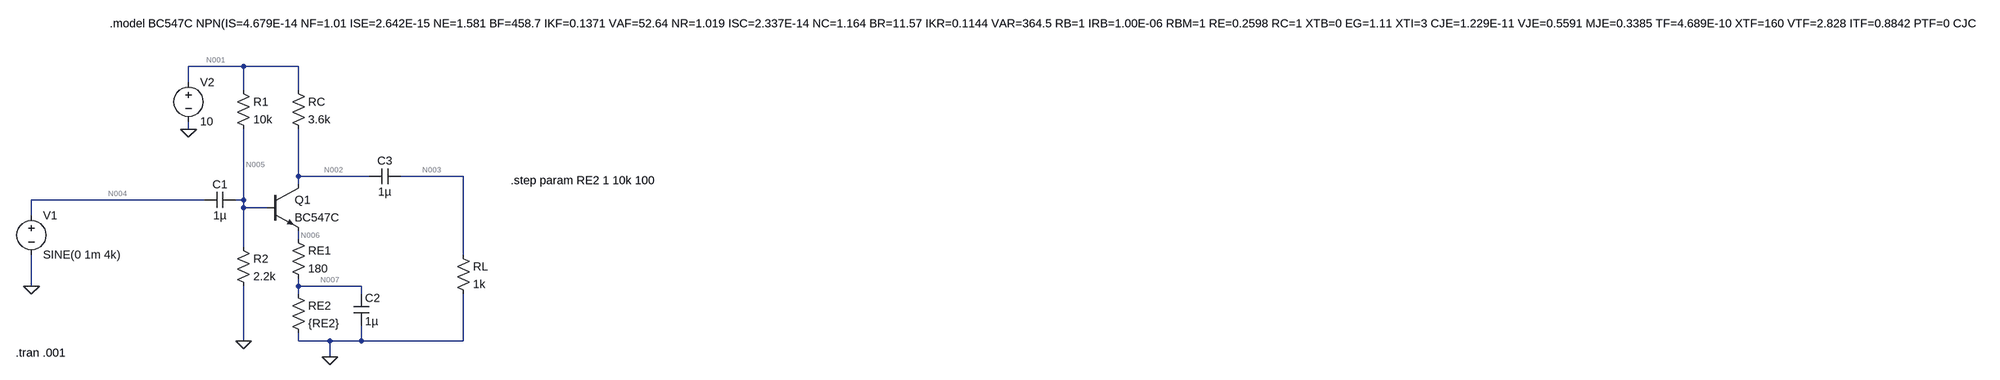
[diagram p0: schematic Draft1.asc]
Draft1.asc, the LTspice schematic file:
Version 4
SHEET 1 5676 680
WIRE 208 -240 96 -240
WIRE 320 -240 208 -240
WIRE 96 -208 96 -240
WIRE 208 -192 208 -240
WIRE 320 -192 320 -240
WIRE 96 -112 96 -128
WIRE 320 -16 320 -112
WIRE 464 -16 320 -16
WIRE 656 -16 528 -16
WIRE 320 0 320 -16
WIRE 128 32 -224 32
WIRE 208 32 208 -112
WIRE 208 32 192 32
WIRE 208 48 208 32
WIRE 256 48 208 48
WIRE -224 64 -224 32
WIRE 320 112 320 96
WIRE 208 128 208 48
WIRE 656 144 656 -16
WIRE -224 208 -224 144
WIRE 320 208 320 192
WIRE 448 208 320 208
WIRE 320 224 320 208
WIRE 448 224 448 208
WIRE 208 320 208 208
WIRE 320 320 320 304
WIRE 384 320 320 320
WIRE 448 320 448 288
WIRE 448 320 384 320
WIRE 656 320 656 224
WIRE 656 320 448 320
WIRE 384 352 384 320
FLAG 96 -112 0
FLAG -224 208 0
FLAG 208 320 0
FLAG 384 352 0
SYMBOL voltage -224 48 R0
WINDOW 123 0 0 Left 0
WINDOW 39 0 0 Left 0
SYMATTR InstName V1
SYMATTR Value SINE(0 1m 4k)
SYMBOL res 304 208 R0
SYMATTR InstName RE2
SYMATTR Value {RE2}
SYMBOL res 304 96 R0
SYMATTR InstName RE1
SYMATTR Value 180
SYMBOL cap 192 16 R90
WINDOW 0 0 32 VBottom 2
WINDOW 3 32 32 VTop 2
SYMATTR InstName C1
SYMATTR Value 1µ
SYMBOL cap 528 -32 R90
WINDOW 0 0 32 VBottom 2
WINDOW 3 32 32 VTop 2
SYMATTR InstName C3
SYMATTR Value 1µ
SYMBOL res 640 128 R0
SYMATTR InstName RL
SYMATTR Value 1k
SYMBOL res 304 -208 R0
SYMATTR InstName RC
SYMATTR Value 3.6k
SYMBOL res 192 -208 R0
SYMATTR InstName R1
SYMATTR Value 10k
SYMBOL voltage 96 -224 R0
WINDOW 123 0 0 Left 0
WINDOW 39 0 0 Left 0
SYMATTR InstName V2
SYMATTR Value 10
SYMBOL res 192 112 R0
SYMATTR InstName R2
SYMATTR Value 2.2k
SYMBOL cap 432 224 R0
SYMATTR InstName C2
SYMATTR Value 1µ
SYMBOL npn 256 0 R0
SYMATTR InstName Q1
SYMATTR Value BC547C
TEXT -64 -328 Left 2 !.model BC547C NPN(IS=4.679E-14 NF=1.01 ISE=2.642E-15 NE=1.581 BF=458.7 IKF=0.1371 VAF=52.64 NR=1.019 ISC=2.337E-14 NC=1.164 BR=11.57 IKR=0.1144 VAR=364.5 RB=1 IRB=1.00E-06 RBM=1 RE=0.2598 RC=1 XTB=0 EG=1.11 XTI=3 CJE=1.229E-11 VJE=0.5591 MJE=0.3385 TF=4.689E-10 XTF=160 VTF=2.828 ITF=0.8842 PTF=0 CJC=4.42E-12 VJC=0.1994 MJC=0.2782 XCJC=0.6193 TR=1.00E-32 CJS=0 VJS=0.75 MJS=0.333 FC=0.7936 Vceo=45 Icrating=100m mfg=Philips)
TEXT 752 -8 Left 2 !.step param RE2 1 10k 100
TEXT -256 344 Left 2 !.tran .001

The netlist it stands for:
* Draft1.asc
V1 N004 0 SINE(0 1m 4k)
RE2 N007 0 {RE2}
RE1 N006 N007 180
C1 N005 N004 1µ
C3 N003 N002 1µ
RL N003 0 1k
RC N001 N002 3.6k
R1 N001 N005 10k
V2 N001 0 10
R2 N005 0 2.2k
C2 N007 0 1µ
Q1 N002 N005 N006 0 BC547C
.model NPN NPN
.model PNP PNP
.lib standard.bjt
.model BC547C NPN(IS=4.679E-14 NF=1.01 ISE=2.642E-15 NE=1.581 BF=458.7 IKF=0.1371 VAF=52.64 NR=1.019 ISC=2.337E-14 NC=1.164 BR=11.57 IKR=0.1144 VAR=364.5 RB=1 IRB=1.00E-06 RBM=1 RE=0.2598 RC=1 XTB=0 EG=1.11 XTI=3 CJE=1.229E-11 VJE=0.5591 MJE=0.3385 TF=4.689E-10 XTF=160 VTF=2.828 ITF=0.8842 PTF=0 CJC=4.42E-12 VJC=0.1994 MJC=0.2782 XCJC=0.6193 TR=1.00E-32 CJS=0 VJS=0.75 MJS=0.333 FC=0.7936 Vceo=45 Icrating=100m mfg=Philips)
.step param RE2 1 10k 100
.tran .001
.backanno
.end

* Results of the author's LTspice run, read from the files saved beside the schematic
* Operating Point (first step), zero values left out:
*   re2 = 1 
*   V(n007) = 2.956 mV
*   V(n006) = 535.1 mV
*   V(n005) = 1.205 V
*   V(n002) = 551.9 mV
*   V(n001) = 10 V
*   Ic(Q1) = 2.624 mA
*   Ib(Q1) = 331.9 µA
*   Ie(Q1) = -2.956 mA
*   I(Re2) = 2.956 mA
*   I(Re1) = 2.956 mA
*   I(Rc) = 2.624 mA
*   I(R1) = 879.5 µA
*   I(R2) = 547.6 µA
*   I(V2) = -3.504 mA
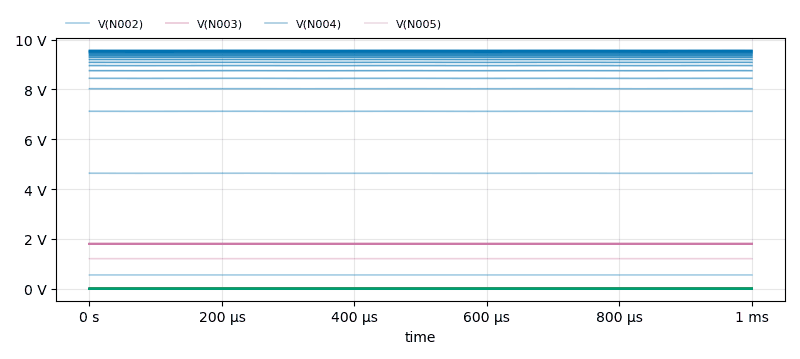
[diagram p1: Transient Analysis of Draft1.asc, plotted from the saved traces]
* Transient Analysis, 101 runs:
*   V(N002) [run 1]: min 551.3 mV, max 552.5 mV, average 551.9 mV, rms 551.9 mV, last 552.1 mV
*   V(N002) [run 2]: min 4.63 V, max 4.638 V, average 4.634 V, rms 4.634 V, last 4.634 V
*   V(N002) [run 3]: min 7.117 V, max 7.124 V, average 7.121 V, rms 7.121 V, last 7.12 V
*   V(N002) [run 4]: min 8.023 V, max 8.03 V, average 8.026 V, rms 8.026 V, last 8.025 V
*   V(N002) [run 5]: min 8.44 V, max 8.446 V, average 8.443 V, rms 8.443 V, last 8.442 V
*   V(N002) [run 6]: min 8.747 V, max 8.753 V, average 8.75 V, rms 8.75 V, last 8.749 V
*   V(N002) [run 7]: min 8.952 V, max 8.958 V, average 8.955 V, rms 8.955 V, last 8.954 V
*   V(N002) [run 8]: min 9.08 V, max 9.086 V, average 9.083 V, rms 9.083 V, last 9.083 V
*   V(N003) [run 1]: min -613.4 µV, max 567.4 µV, average -22.75 µV, rms 394.3 µV, last 142.5 µV
*   V(N003) [run 2]: min -3.793 mV, max 4.078 mV, average 138.1 µV, rms 2.659 mV, last -841.1 µV
*   V(N003) [run 3]: min -3.563 mV, max 3.862 mV, average 139.8 µV, rms 2.498 mV, last -754.6 µV
*   V(N003) [run 4]: min -3.344 mV, max 3.629 mV, average 134.5 µV, rms 2.346 mV, last -671.9 µV
*   V(N003) [run 5]: min -3.169 mV, max 3.446 mV, average 127.3 µV, rms 2.23 mV, last -610.3 µV
*   V(N003) [run 6]: min -2.995 mV, max 3.239 mV, average 113.8 µV, rms 2.108 mV, last -548.8 µV
*   V(N003) [run 7]: min -2.832 mV, max 3.086 mV, average 118.4 µV, rms 1.996 mV, last -494 µV
*   V(N003) [run 8]: min -2.707 mV, max 2.947 mV, average 113.7 µV, rms 1.91 mV, last -454.1 µV
*   V(N004) [run 1]: min -1 mV, max 999.9 µV, average 98.61 nV, rms 707.5 µV, last 0 V
*   V(N004) [run 2]: min -999.9 µV, max 1 mV, average 103.8 nV, rms 707.3 µV, last 0 V
*   V(N004) [run 3]: min -999.9 µV, max 999.5 µV, average 92.71 nV, rms 707.4 µV, last 0 V
*   V(N004) [run 4]: min -1 mV, max 1 mV, average 94.4 nV, rms 707.5 µV, last 0 V
*   V(N004) [run 5]: min -1 mV, max 999.9 µV, average 76.13 nV, rms 707.6 µV, last 0 V
*   V(N004) [run 6]: min -1 mV, max 1 mV, average 61.07 nV, rms 707.7 µV, last 0 V
*   V(N004) [run 7]: min -999.1 µV, max 1 mV, average 71.17 nV, rms 707.7 µV, last 0 V
*   V(N004) [run 8]: min -1 mV, max 1 mV, average 86.89 nV, rms 707.7 µV, last 0 V
*   V(N005) [run 1]: min 1.204 V, max 1.206 V, average 1.205 V, rms 1.205 V, last 1.205 V
*   V(N005) [run 2]: min 1.797 V, max 1.799 V, average 1.798 V, rms 1.798 V, last 1.798 V
*   V(N005) [run 3]: min 1.799 V, max 1.801 V, average 1.8 V, rms 1.8 V, last 1.8 V
*   V(N005) [run 4]: min 1.8 V, max 1.802 V, average 1.801 V, rms 1.801 V, last 1.801 V
*   V(N005) [run 5]: min 1.801 V, max 1.803 V, average 1.802 V, rms 1.802 V, last 1.802 V
*   V(N005) [run 6]: min 1.801 V, max 1.803 V, average 1.802 V, rms 1.802 V, last 1.802 V
*   V(N005) [run 7]: min 1.801 V, max 1.803 V, average 1.802 V, rms 1.802 V, last 1.802 V
*   V(N005) [run 8]: min 1.801 V, max 1.803 V, average 1.802 V, rms 1.802 V, last 1.802 V